# EAGLE design toppanel2 (EAGLE 7.2.0)
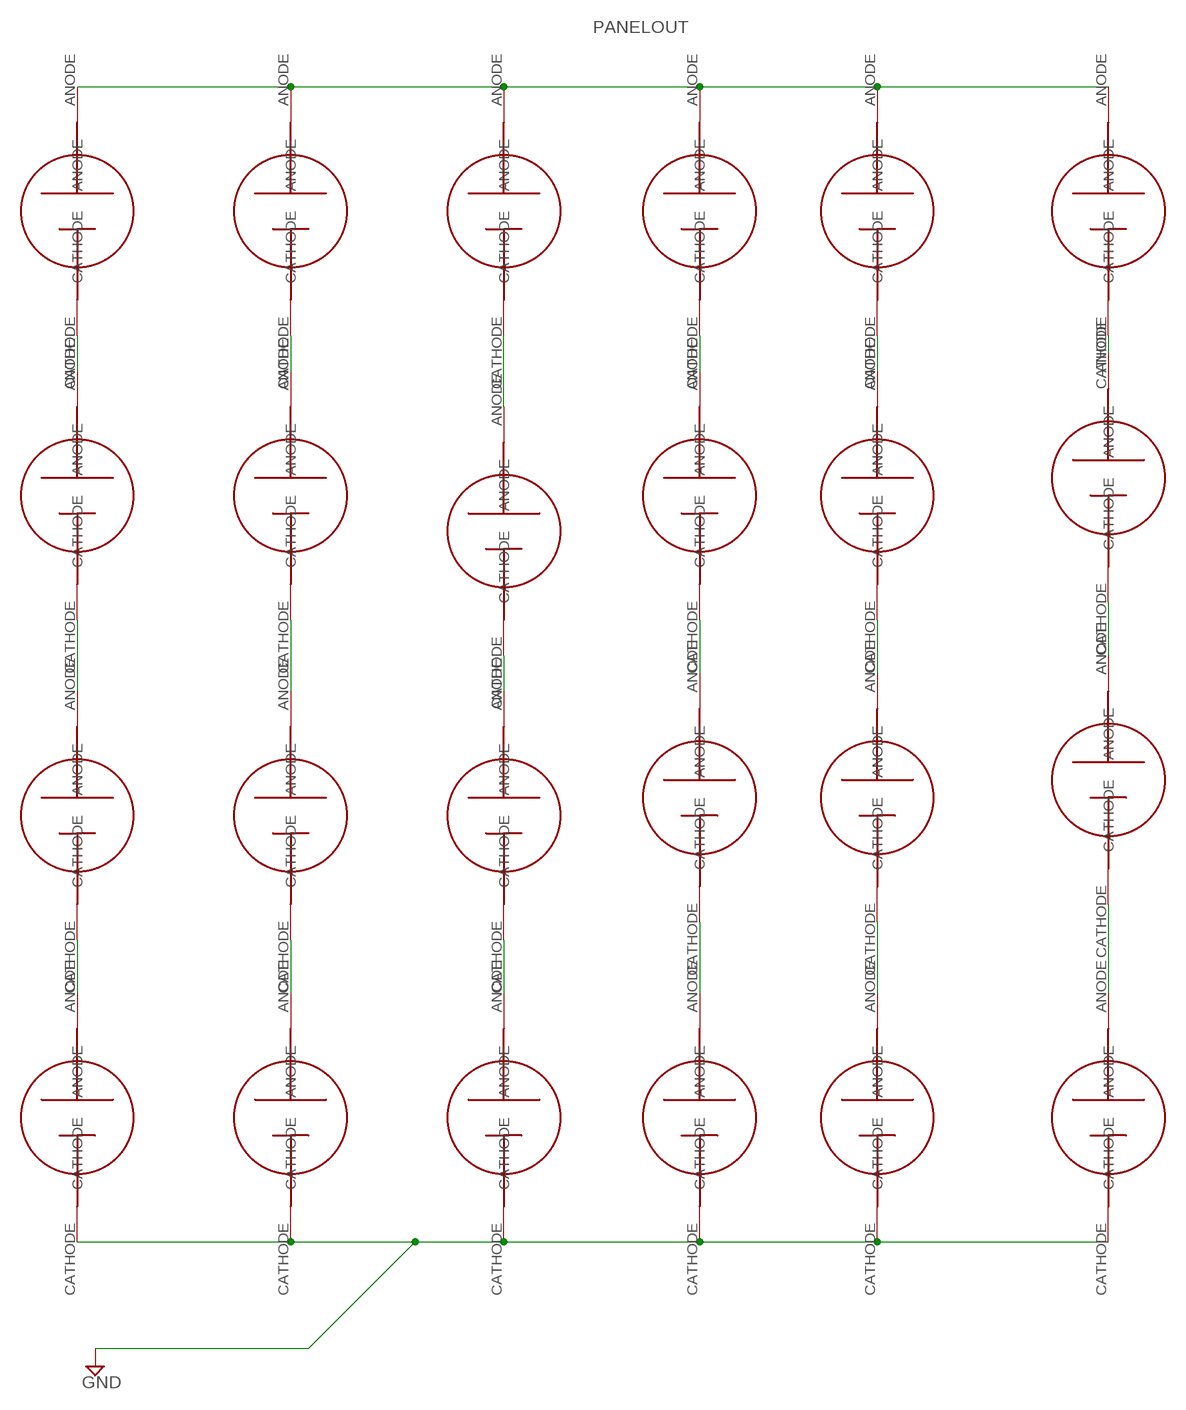
[diagram p0: schematic, sheet 1]

## Parts
1A  SOLARCELL  [SOLARCELL]
1B  SOLARCELL  [SOLARCELL]
1C  SOLARCELL  [SOLARCELL]
1D  SOLARCELL  [SOLARCELL]
2A  SOLARCELL  [SOLARCELL]
2B  SOLARCELL  [SOLARCELL]
2C  SOLARCELL  [SOLARCELL]
2D  SOLARCELL  [SOLARCELL]
3A  SOLARCELL  [SOLARCELL]
3B  SOLARCELL  [SOLARCELL]
3C  SOLARCELL  [SOLARCELL]
3D  SOLARCELL  [SOLARCELL]
4A  SOLARCELL  [SOLARCELL]
4B  SOLARCELL  [SOLARCELL]
4C  SOLARCELL  [SOLARCELL]
4D  SOLARCELL  [SOLARCELL]
5A  SOLARCELL  [SOLARCELL]
5B  SOLARCELL  [SOLARCELL]
5C  SOLARCELL  [SOLARCELL]
5D  SOLARCELL  [SOLARCELL]
6A  SOLARCELL  [SOLARCELL]
6B  SOLARCELL  [SOLARCELL]
6C  SOLARCELL  [SOLARCELL]
6D  SOLARCELL  [SOLARCELL]

## Nets
GND: 1A.CATHODE 2A.CATHODE 3A.CATHODE 4A.CATHODE 5A.CATHODE 6A.CATHODE
N$1: 1C.ANODE 1D.CATHODE
N$2: 1B.ANODE 1C.CATHODE
N$3: 1A.ANODE 1B.CATHODE
N$4: 2C.ANODE 2D.CATHODE
N$5: 2B.ANODE 2C.CATHODE
N$6: 2A.ANODE 2B.CATHODE
N$7: 3C.ANODE 3D.CATHODE
N$8: 3B.ANODE 3C.CATHODE
N$9: 3A.ANODE 3B.CATHODE
N$10: 4C.ANODE 4D.CATHODE
N$11: 4B.ANODE 4C.CATHODE
N$12: 4A.ANODE 4B.CATHODE
N$13: 5C.ANODE 5D.CATHODE
N$14: 5B.ANODE 5C.CATHODE
N$15: 5A.ANODE 5B.CATHODE
N$16: 6C.ANODE 6D.CATHODE
N$17: 6B.ANODE 6C.CATHODE
N$18: 6A.ANODE 6B.CATHODE
PANELOUT: 1D.ANODE 2D.ANODE 3D.ANODE 4D.ANODE 5D.ANODE 6D.ANODE

## Library data of the parts
1A 1B 1C 1D 2A 2B 2C 2D 3A 3B 3C 3D 4A 4B 4C 4D 5A 5B 5C 5D 6A 6B 6C 6D = SolarCell:SOLARCELL

## Board
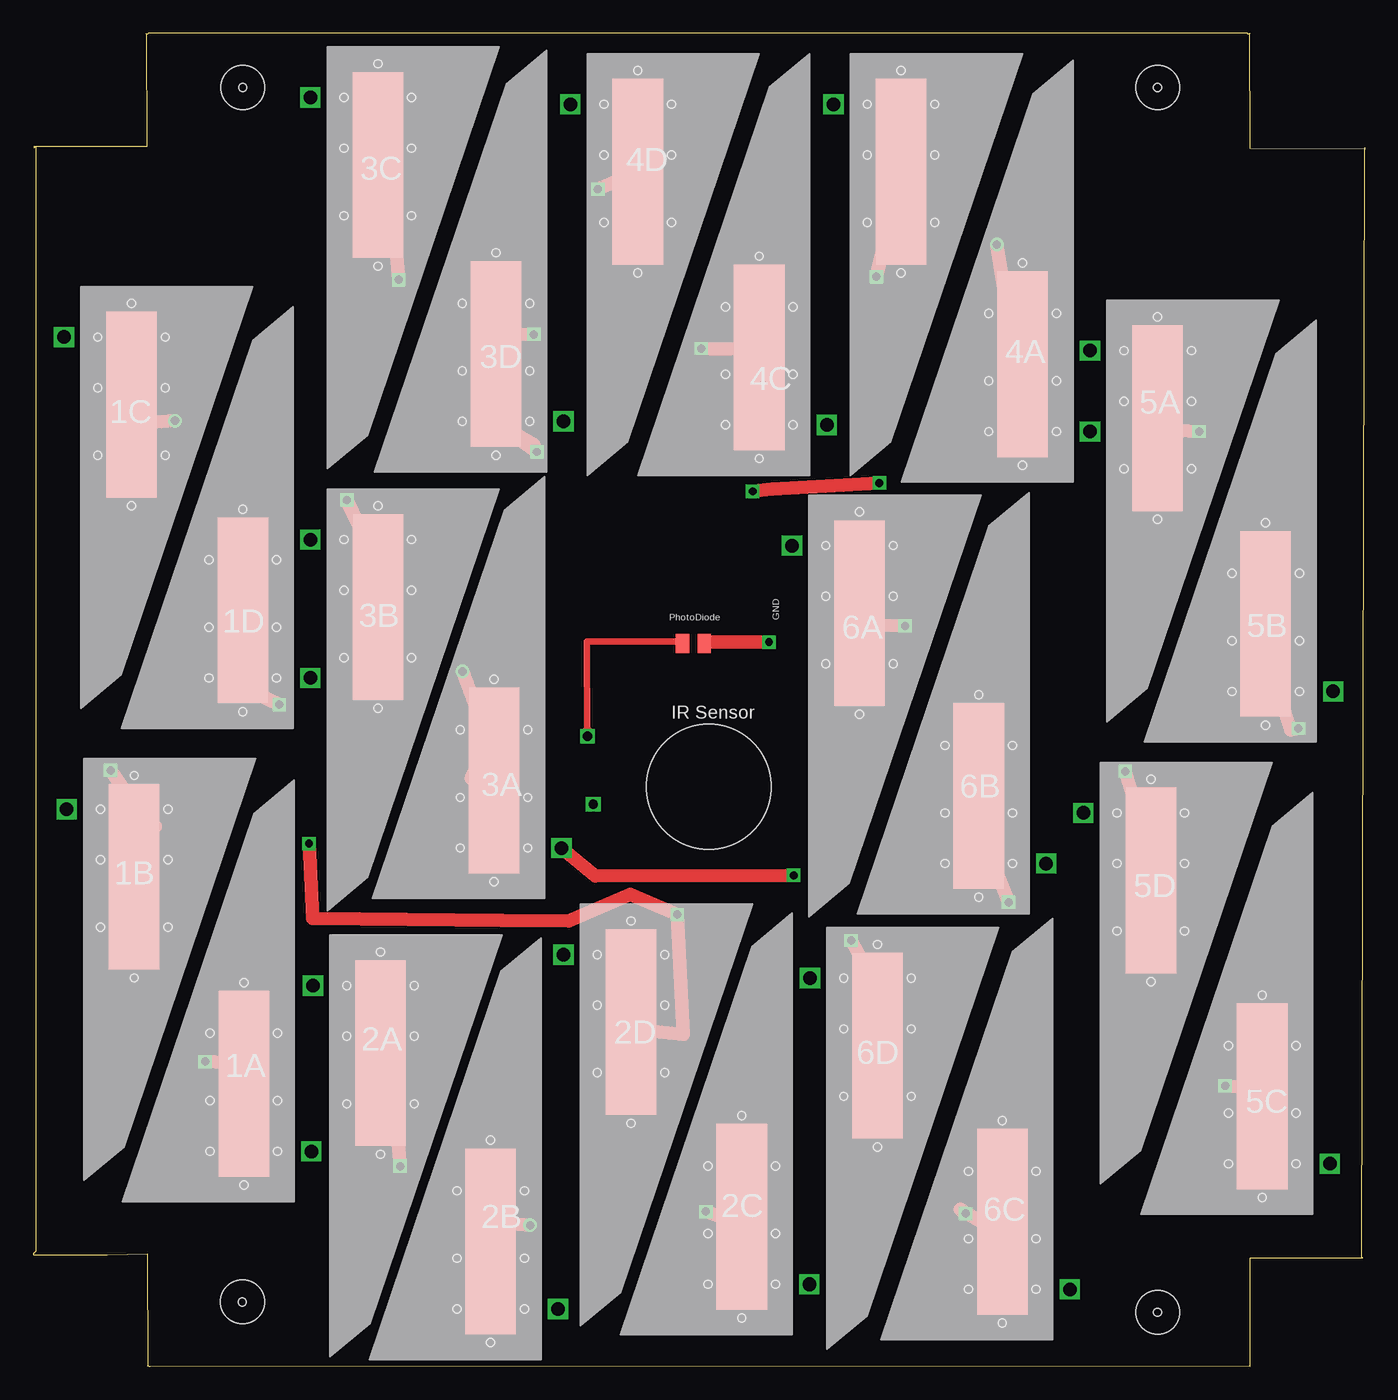
[diagram p1: board, top side]
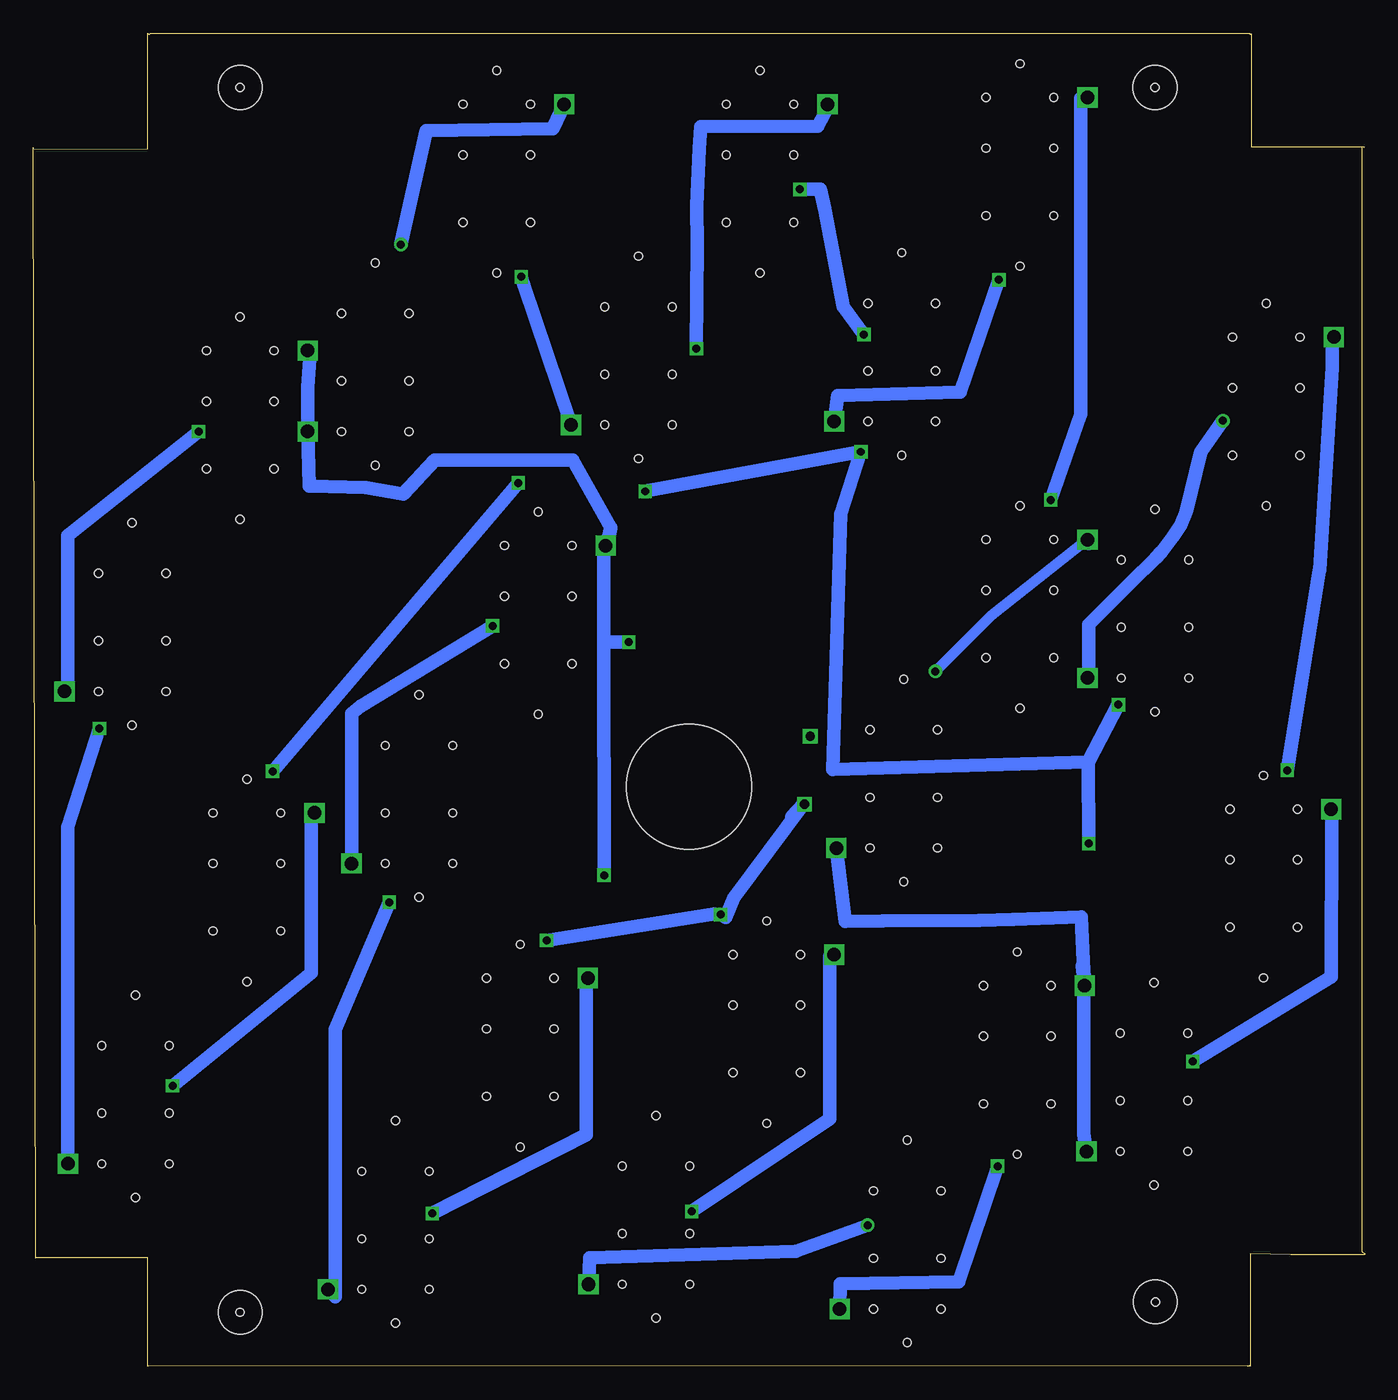
[diagram p2: board, bottom side, seen from below]

Size 100.18 x 100.35 mm. Coordinates in mm from the lower left corner, seen from the top.
Outline: 100.18,91.62 100.18,91.75 99.97,8.15 100.03,8.15 91.57,8.15 91.57,0 91.52,0.05 8.81,0 8.69,0 8.66,0.02 8.64,0.02 8.61,0 8.59,8.46 5.56,8.41 0.03,8.41 0,8.43 0,8.48 0.2,8.66 0.2,91.82 0.08,91.72 0.08,91.75 0.03,91.8 8.53,91.81 8.52,100.32 8.56,100.28 8.61,100.28 8.66,100.33 91.36,100.33 91.41,100.28 91.49,100.28 91.56,100.34 91.57,91.66 100.18,91.62
Outline: 100.18,91.62 100.18,91.62
Copper layers (1*16): Top 0.035mm / dielectric 1.5mm / Bottom 0.035mm
Design rules "default *": minimum track width 40mil, minimum drill 24mil, track to track 8mil, track to pad 8mil, pad to pad 8mil, via to via 8mil, smd to smd 8mil, copper to edge 40mil, drill to drill 8mil, minimum pad ring 10mil, minimum via ring 8mil, stop-mask expansion 4mil, vias tented up to drill 0mil, thermal gap 10mil
Holes 0.6 mm at 15.77,96.27 84.61,96.27 15.74,4.84 84.61,4.06
Holes 3.3 mm at 15.75,4.85 84.61,4.06 84.61,96.27 15.77,96.27
Holes 9.4 mm at 50.83,43.63

### Footprints (pad centres in the part's own frame; a part is rotated, then mirrored left to right if it is on the bottom)
SOLARCELL = smd 3.81 x 13.97: ANODE -3.81,8.89 | drill 1.016 square: CATHODE 1.27,3.81 | hole 0.6: -6.35,3.81; -3.81,1.27; -6.35,7.62; -3.81,16.51; -1.27,12.7; -1.27,7.62; -6.35,12.7; -1.27,3.81
PHOTODECTORDEVICE2 = smd 1 x 1.45: GND 0.76,0.4; PWROUT -0.88,0.4

### Placement (x,y rotation side)
1A  19.66,12.37 0 top
1B  3.78,45.75 180 top
1C  3.58,81.28 180 top
1D  19.58,48.01 0 top
2A  22.33,32.46 180 top
2B  38.23,0.51 0 top
2C  57.12,2.36 0 top
2D  41.17,34.8 180 top
3A  38.48,35.2 0 top
3B  22.12,66.04 180 top
3C  22.12,99.31 180 top
3D  38.63,67.31 0 top
4A  78.26,66.55 0 top
4B  61.49,98.81 180 top
4C  58.45,67.06 0 top
4D  41.68,98.81 180 top
5A  80.8,80.26 180 top
5B  96.55,46.99 0 top
5C  96.29,11.43 0 top
5D  80.29,45.47 180 top
6A  58.37,65.58 180 top
6B  74.96,34.04 0 top
6C  76.73,1.98 0 top
6D  59.72,33.02 180 top
E$1  [PHOTODECTORDEVICE2]  49.73,54 0 top

### Tracks (layer width: path | path; a pad name or v marks a point on that pad's centre or on a via)
GND  (via drill 0.6)
  Top 1.016: v57.22,36.96 42.29,36.91 3A.CATHODE | v55.36,54.51 50.71,54.51 | 50.71,54.51 50.63,54.43 | 50.71,54.51 50.73,54.53
  Bottom 1.016: 5A.CATHODE 79.32,76.33 79.5,73.71 4A.CATHODE 79.4,66.25 75.17,66.14 72.32,65.66 69.98,68.22 59.59,68.22 56.72,63.14 56.95,62.03 6A.CATHODE 57.27,61.57 57.25,54.73 | 1A.CATHODE 21.13,17.5 21.13,29.08 21.23,30.15 2A.CATHODE 21.16,30.48 21.31,33.83 26.42,33.63 28.98,33.58 36.25,33.53 39.09,33.5 3A.CATHODE | v57.22,36.96 57.25,54.73 | v55.36,54.51 57.03,54.51 57.25,54.73
N$1  (via drill 0.61)
  Top 1.016: v10.67,71.17 9.17,71.07 7.95,72.29 1C.ANODE
  Bottom 1.016: v10.67,71.17 12.32,68.83 13.42,64.35 13.84,63.34 14.45,62.43 15.27,61.32 15.77,60.81 17.59,58.98 17.7,58.88 20.75,55.83 20.75,52.17 1D.CATHODE
N$2  (via drill 0.6)
  Top 1.016: v5.82,44.86 8.66,40.74 9.17,40.64 7.67,40.59 7.95,40.59 6.73,39.37 6.73,37.54 1B.ANODE
  Bottom 1.016: v5.82,44.86 3.4,59.89 3.35,59.92 2.41,75.18 2.44,77.34 2.31,77.65 2.39,77.5 1C.CATHODE
N$3  (via drill 0.6)
  Top 1.016: v12.93,22.94 15.98,22.78 14.66,22.3 1A.ANODE
  Bottom 1.016: v12.93,22.94 2.49,29.31 2.46,40.82 1B.CATHODE
N$4  (via drill 0.6)
  Top 1.016: v50.62,11.66 53.06,10.72 2C.ANODE
  Bottom 1.016: v50.62,11.66 40.26,18.64 40.26,30.84 2D.CATHODE
N$5  (via drill 0.61)
  Top 1.016: v37.39,10.62 35.99,10.72 35.38,10.11 2B.ANODE
  Bottom 1.016: v37.39,10.62 42.8,8.66 58.32,8.16 58.39,6.3 58.45,6.3 2C.CATHODE
N$6  (via drill 0.6)
  Top 1.016: v27.61,15.06 26.85,23.52 26.24,24.13 2A.ANODE
  Bottom 1.016: v27.61,15.06 30.54,6.37 39.47,6.2 2B.CATHODE
N$7  (via drill 0.6)
  Top 1.016: v27.51,81.79 26.85,89.36 26.24,89.97 3C.ANODE
  Bottom 1.016: v27.51,81.79 30.44,73.34 39.66,73.08 3D.CATHODE
N$8  (via drill 0.6)
  Top 1.016: v23.61,65.22 27.36,57.38 26.7,56.49 26.24,56.44 25.63,57.05 3B.ANODE
  Bottom 1.016: v23.61,65.22 21.36,71.68 21.36,95.45 3C.CATHODE
N$9  (via drill 0.61)
  Top 1.016: v32.3,52.31 34.26,47.04 32.94,44.25 33.55,43.64 3A.ANODE
  Bottom 0.8: v32.3,52.31 28.08,56.51 3B.CATHODE
  Bottom 1.016: 20.75,61.92 3B.CATHODE
N$10  (via drill 0.6)
  Top 1.016: v50.27,76.6 53.67,76.56 54.28,75.95 4C.ANODE
  Bottom 1.016: v50.27,76.6 50.2,84.35 50.25,87.37 50.05,91.64 49.96,93.3 41.16,93.34 40.34,94.89 4D.CATHODE
N$11  (via drill 0.6)
  Top 1.016: v63.45,82.01 65.25,89.36 4B.ANODE
  Bottom 1.016: v63.45,82.01 63.25,81.41 59.77,71.07 4C.CATHODE
N$12  (via drill 0.61)
  Top 1.016: v72.52,84.43 73.79,76.56 74.4,75.95 4A.ANODE
  Bottom 1.016: v72.52,84.43 70.59,92.99 61.08,93.14 4B.CATHODE
N$13  (via drill 0.6)
  Top 1.016: v89.69,21.11 92.02,20.9 92.08,20.47 5C.ANODE
  Bottom 1.016: v89.69,21.11 79.27,29.62 79.27,41.2 5D.CATHODE
N$14  (via drill 0.6)
  Top 1.016: v95.2,48.01 94.64,47.9 93.01,52.83 91.47,52.78 92.68,54 92.68,55.83 5B.ANODE
  Bottom 1.016: 5C.CATHODE 97.56,40.59 v95.2,48.01
N$15  (via drill 0.6)
  Top 1.016: v87.73,70.36 85.37,70.46 84.76,71.07 5A.ANODE
  Bottom 1.016: v87.73,70.36 97.56,62.53 97.56,50.95 5B.CATHODE
N$16  (via drill 0.6)
  Top 1.016: v70.15,11.51 69.77,11.81 72.57,10.11 6C.ANODE
  Bottom 1.016: v70.15,11.51 58.55,17.42 58.55,29.01 6D.CATHODE
N$17  (via drill 0.6)
  Top 1.016: v73.39,34.93 70.03,43.41 69.8,43.64 70.05,43.46 70.13,43.03 6B.ANODE
  Bottom 1.016: v73.39,34.93 77.44,25.35 77.44,5.23 6C.CATHODE
N$18  (via drill 0.6)
  Top 1.016: v65.61,55.73 62.2,55.83 61.6,56.44 6A.ANODE
  Bottom 1.016: v65.61,55.73 75.57,49.66 76.23,49.15 6B.CATHODE
PANELOUT  (via drill 0.6, 0.7 pad 0.81)
  Top 1.016: v61.54,32.05 63.04,29.26 63.12,29.16 63.12,23.65 64.64,23.52 64.03,24.13 6D.ANODE | 2D.ANODE 45.14,25.35 48.91,24.99 v48.46,34 44.92,35.53 40.28,33.53 35.31,33.55 21.03,33.73 v20.75,39.34 | v82.17,44.78 84.2,38.12 84.12,35.79 83.77,35.71 85.37,36.32 84.15,36.32 5D.ANODE | v63.68,66.5 55.6,66.04 v54.13,65.86 | 37.67,69.37 34.72,70.23 34.67,70.16 35.36,69.77 34.85,69.98 34.77,76.56 3D.ANODE 35.38,76.56 35.51,77.72 v37.67,77.67 | 37.67,69.37 v37.9,68.83 34.98,70.92 37.67,69.37 | v18.52,49.81 14.91,51.56 15.27,56.11 14.38,57.66 14.83,57.66 14.66,57.05 15.27,57.05 1D.ANODE | v42.49,88.59 4D.ANODE
  Bottom 1.016: v61.54,32.05 48.94,34.04 v48.46,34 48.08,33.78 47.48,35.25 42.19,42.34 43.11,41.34 v42.14,42.32 | v63.68,66.5 v82.17,44.78 | v54.13,65.86 v37.9,68.83 39.4,64.16 40.03,44.91 20.78,45.49 | 20.78,45.49 v18.52,49.81 | v42.49,88.59 40.97,88.61 40.61,87.11 39.22,79.76 v37.67,77.67 | 20.78,45.49 v20.75,39.34
PD  (via drill 0.7 pad 0.81)
  Top 0.5: 41.68,47.62 41.65,54.57 48.72,54.56
  Top 1.016: 41.68,47.62 41.68,47.45 v41.71,47.42

### Text on the board
tPlace: PhotoDiode | GND | IR Sensor
tNames: 4D | 3C | 3D | 4A | 4C | 1C | 5A | 1D | 3B | 5B | 6A | 3A | 6B | 1B | 5D | 2D | 2A | 6D | 1A | 5C | 2C | 6C | 2B
Document: TOP PANEL TASC / V 2.0 | PD | PWR